# EAGLE design Button Board (EAGLE 7.7.0)
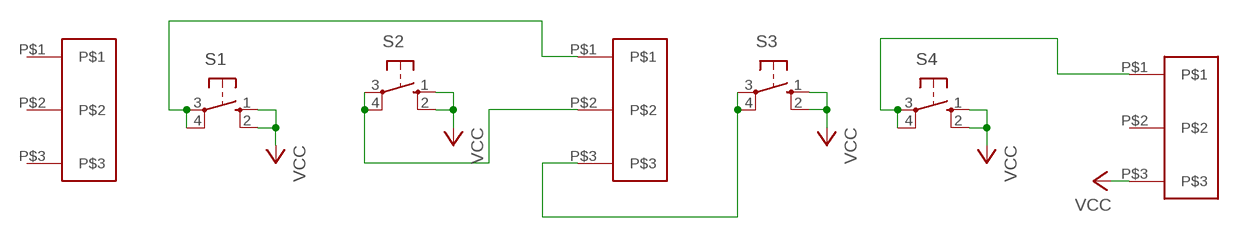
[diagram p0: schematic, sheet 1]

## Parts
S1  40-XX  [B3F-40XX]
S2  40-XX  [B3F-40XX]
S3  40-XX  [B3F-40XX]
S4  40-XX  [B3F-40XX]
U$1  3_PIN_FEMALE_HEADER  [3_PIN_FEMALE_HEADER]
U$2  3_PIN_FEMALE_HEADER  [3_PIN_FEMALE_HEADER]
U$3  3_PIN_FEMALE_HEADER  [3_PIN_FEMALE_HEADER]

## Nets
N$1: S1.3(P) S1.4(P1) U$2.P$1
N$2: S2.3(P) S2.4(P1) U$2.P$2
N$3: S3.3(P) S3.4(P1) U$2.P$3
N$4: S4.3(P) S4.4(P1) U$3.P$1
VCC: S1.1(S) S1.2(S1) S2.1(S) S2.2(S1) S3.1(S) S3.2(S1) S4.1(S) S4.2(S1) U$3.P$3
Unconnected: U$1.P$1 U$1.P$2 U$1.P$3 U$3.P$2

## Library data of the parts
S1-S4 = switch-omron:40-XX: OMRON SWITCH; MF: OMRON COMPONENTS USA; MPN: B3F-4000; OC_FARNELL: 176434; OC_NEWARK: 36K3105
U$1-U$3 = KWHr Library:3_PIN_FEMALE_HEADER

## Board
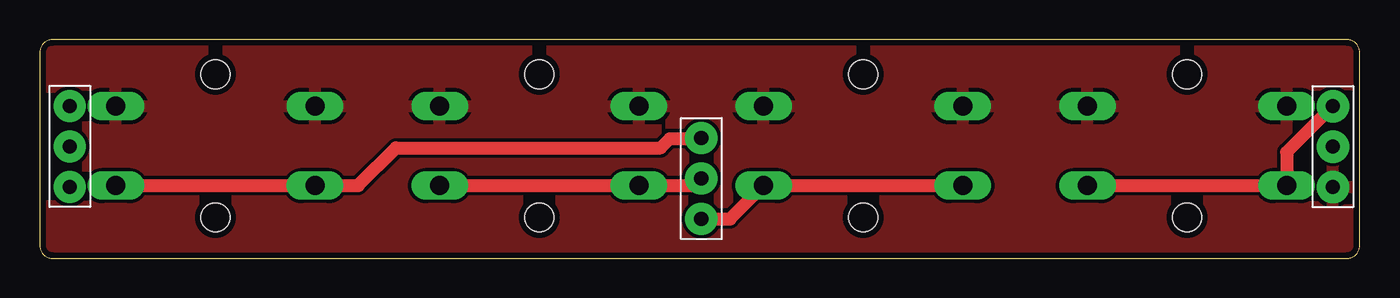
[diagram p1: board, top side]
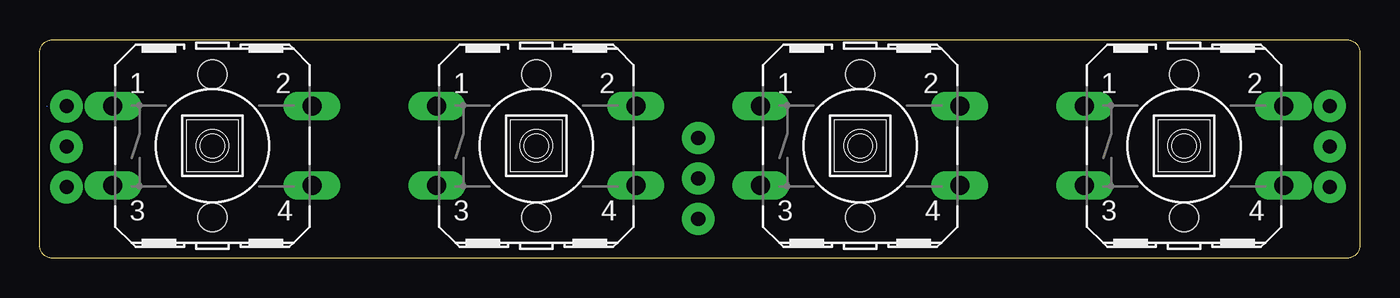
[diagram p2: board, bottom side, seen from below]

Size 82.8 x 13.72 mm. Coordinates in mm from the lower left corner, seen from the top.
Outline: 82.04,13.72 0.76,13.72 arc90 0,12.95 0,0.76 arc90 0.76,0 82.04,0 arc90 82.8,0.76 82.8,12.95 arc90 82.04,13.72
Copper layers (1*16): Top 0.035mm / dielectric 1.5mm / Bottom 0.035mm
Design rules "default *": minimum track width 10mil, minimum drill 24mil, track to track 8mil, track to pad 8mil, pad to pad 8mil, via to via 8mil, smd to smd 8mil, copper to edge 15mil, drill to drill 16mil, minimum pad ring 10mil, minimum via ring 8mil, stop-mask expansion 4mil, vias tented up to drill 0mil, thermal gap 10mil

### Footprints (pad centres in the part's own frame; a part is rotated, then mirrored left to right if it is on the bottom)
B3F-40XX = drill 1.194 long: 1 -6.248,2.489; 2 6.248,2.489; 3 -6.248,-2.489; 4 6.248,-2.489 | hole 1.8: 0,-4.496 | hole 1.803: 0,4.496
3_PIN_FEMALE_HEADER = drill 0.889 pad 2.032: P$1 0,0; P$2 2.54,0; P$3 5.08,0

### Placement (x,y rotation side)
S1  11.01,7.05 0 bottom
S2  31.33,7.05 0 bottom
S3  51.65,7.05 0 bottom
S4  71.97,7.05 0 bottom
U$1  1.88,4.47 90 top
U$2  41.5,7.54 270 top
U$3  81.12,9.55 270 top

### Tracks (layer width: path | path; a pad name or v marks a point on that pad's centre or on a via)
N$1
  Top 0.813: S1.4 S1.3 19.98,4.56 22.35,6.93 38.95,6.93 39.52,7.51 41.47,7.51 U$2.P$1
N$2
  Top 0.813: S2.4 S2.3 41.06,4.56 U$2.P$2
N$3
  Top 0.813: U$2.P$3 43.3,2.46 S3.4 S3.3
N$4
  Top 0.813: S4.4 S4.3 78.23,6.66 81.11,9.55 U$3.P$1
N$6
  Bottom 0.01: 82.37,9.55 82.37,9.53
VCC
  pour Top: 0,13.72 82.8,13.72 82.8,0 0,0